# EAGLE design RBStation (EAGLE 6.1)
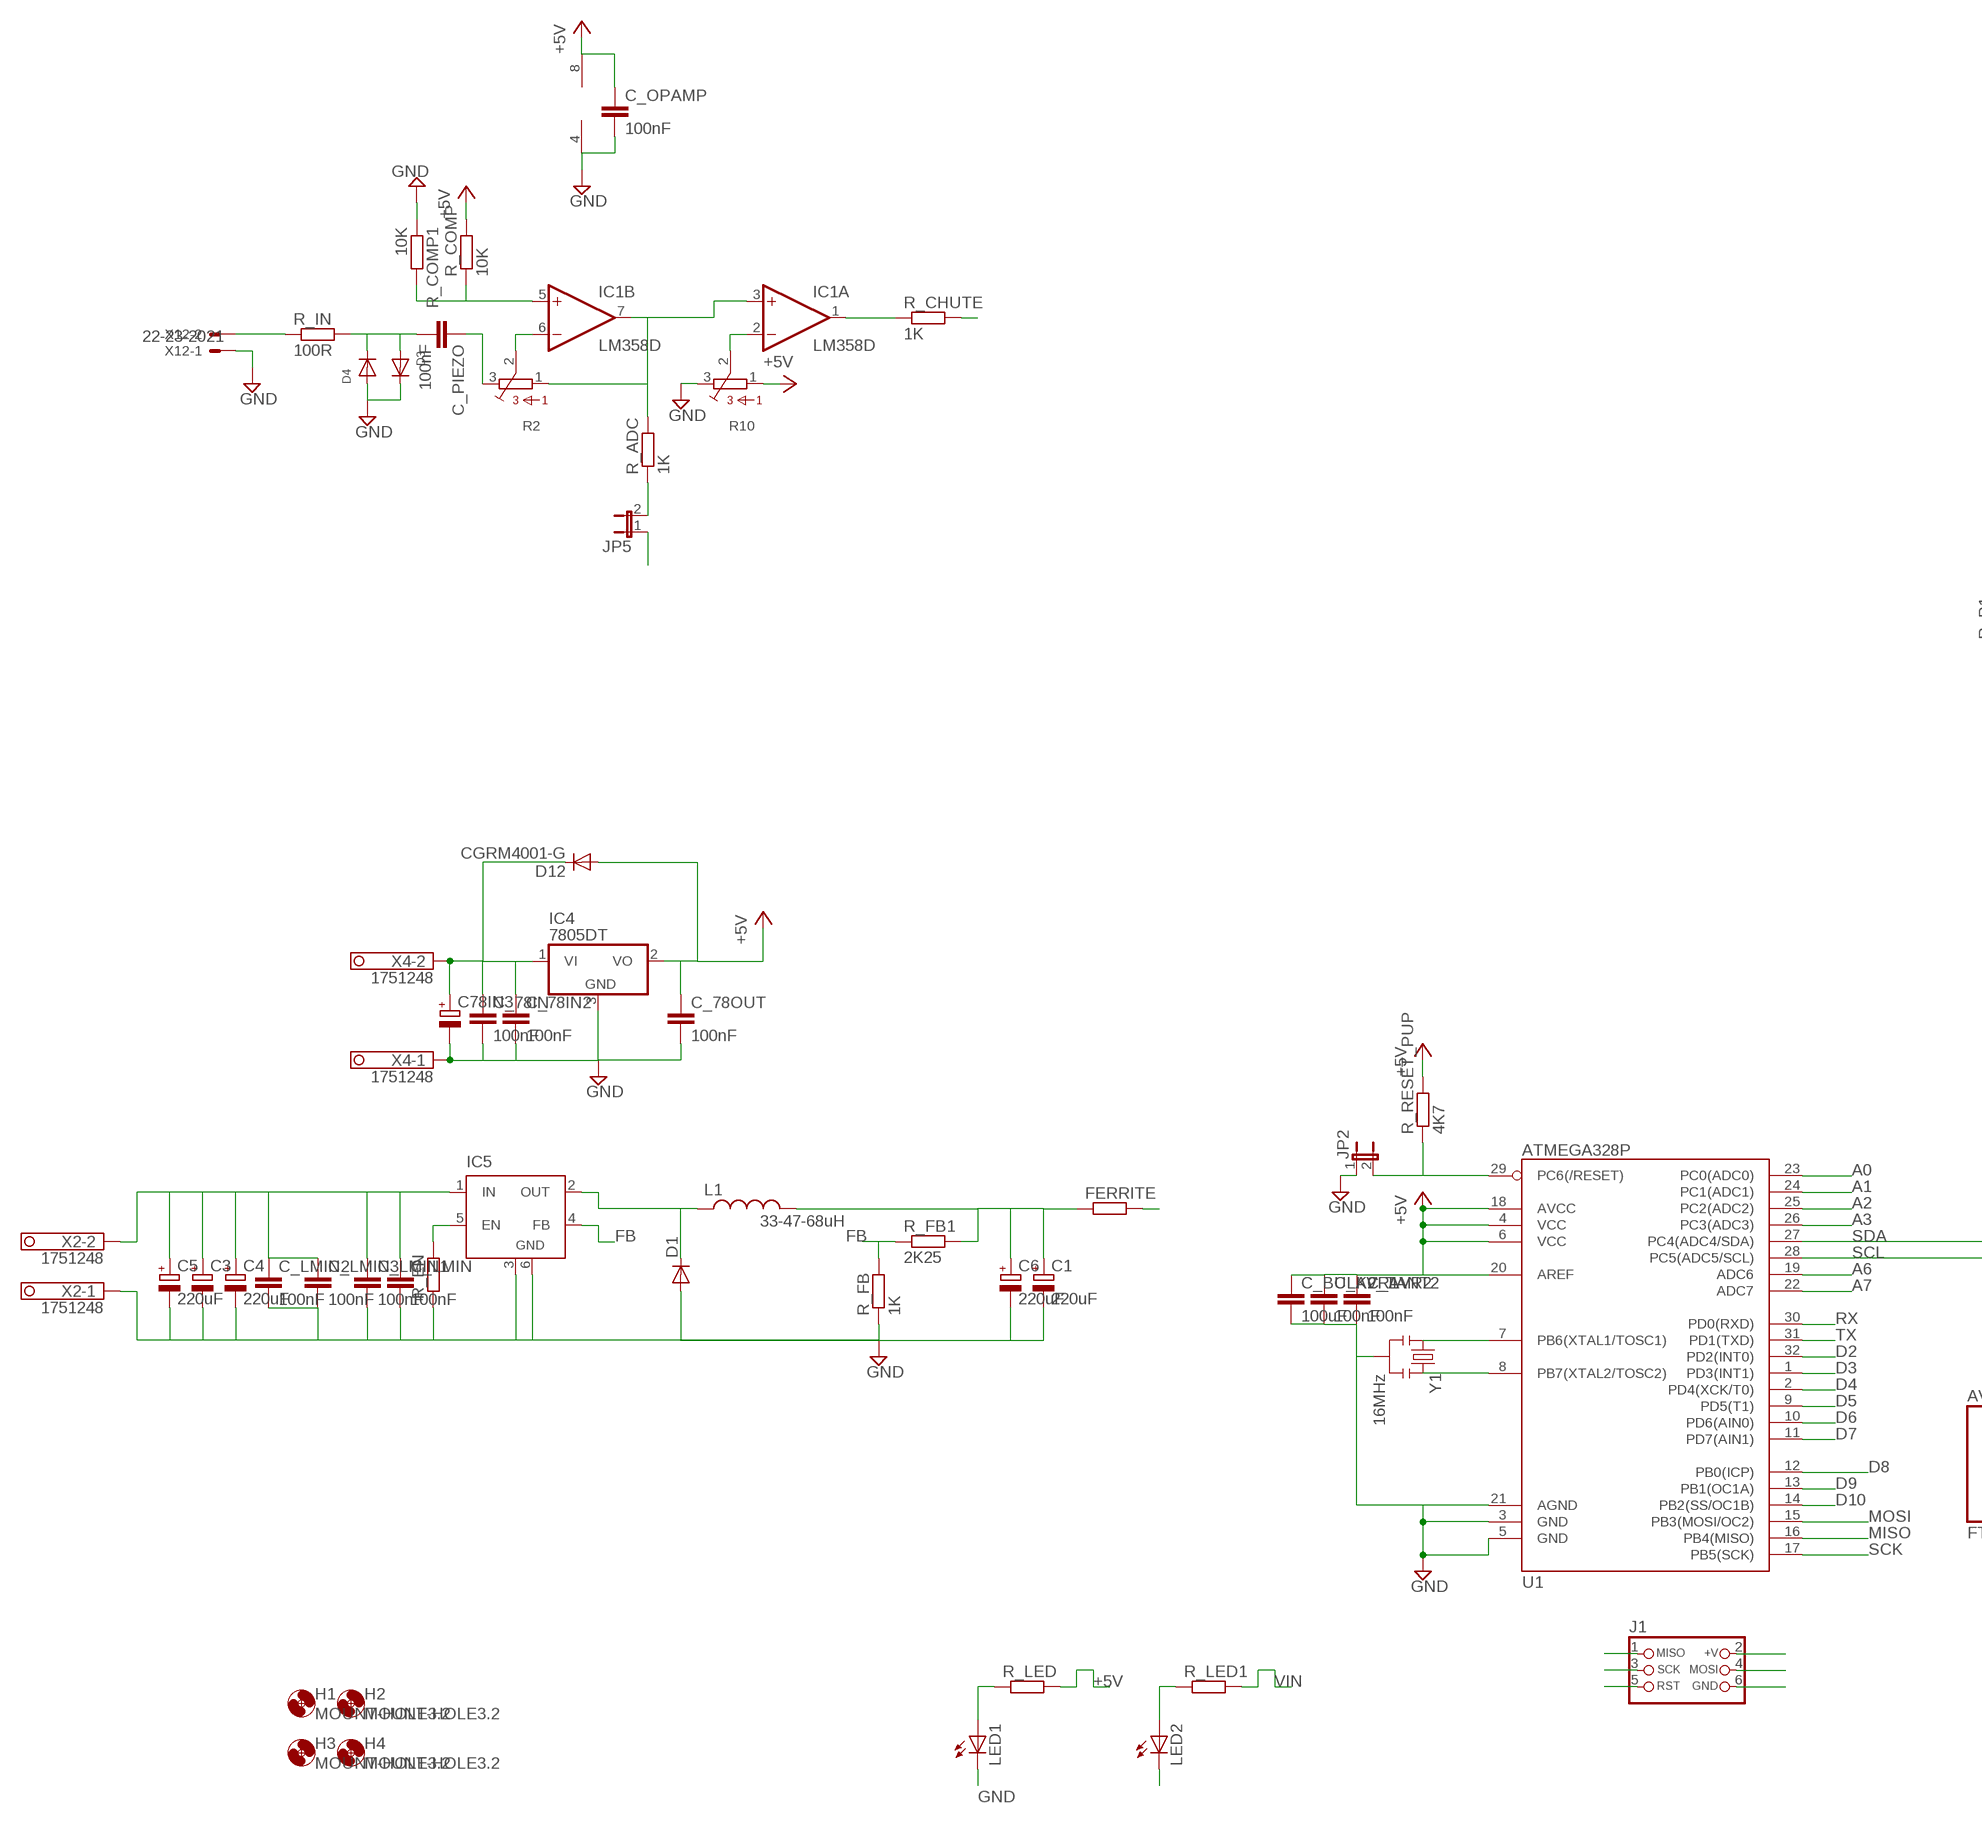
[diagram p0: schematic, sheet 1, part 1 of 2]
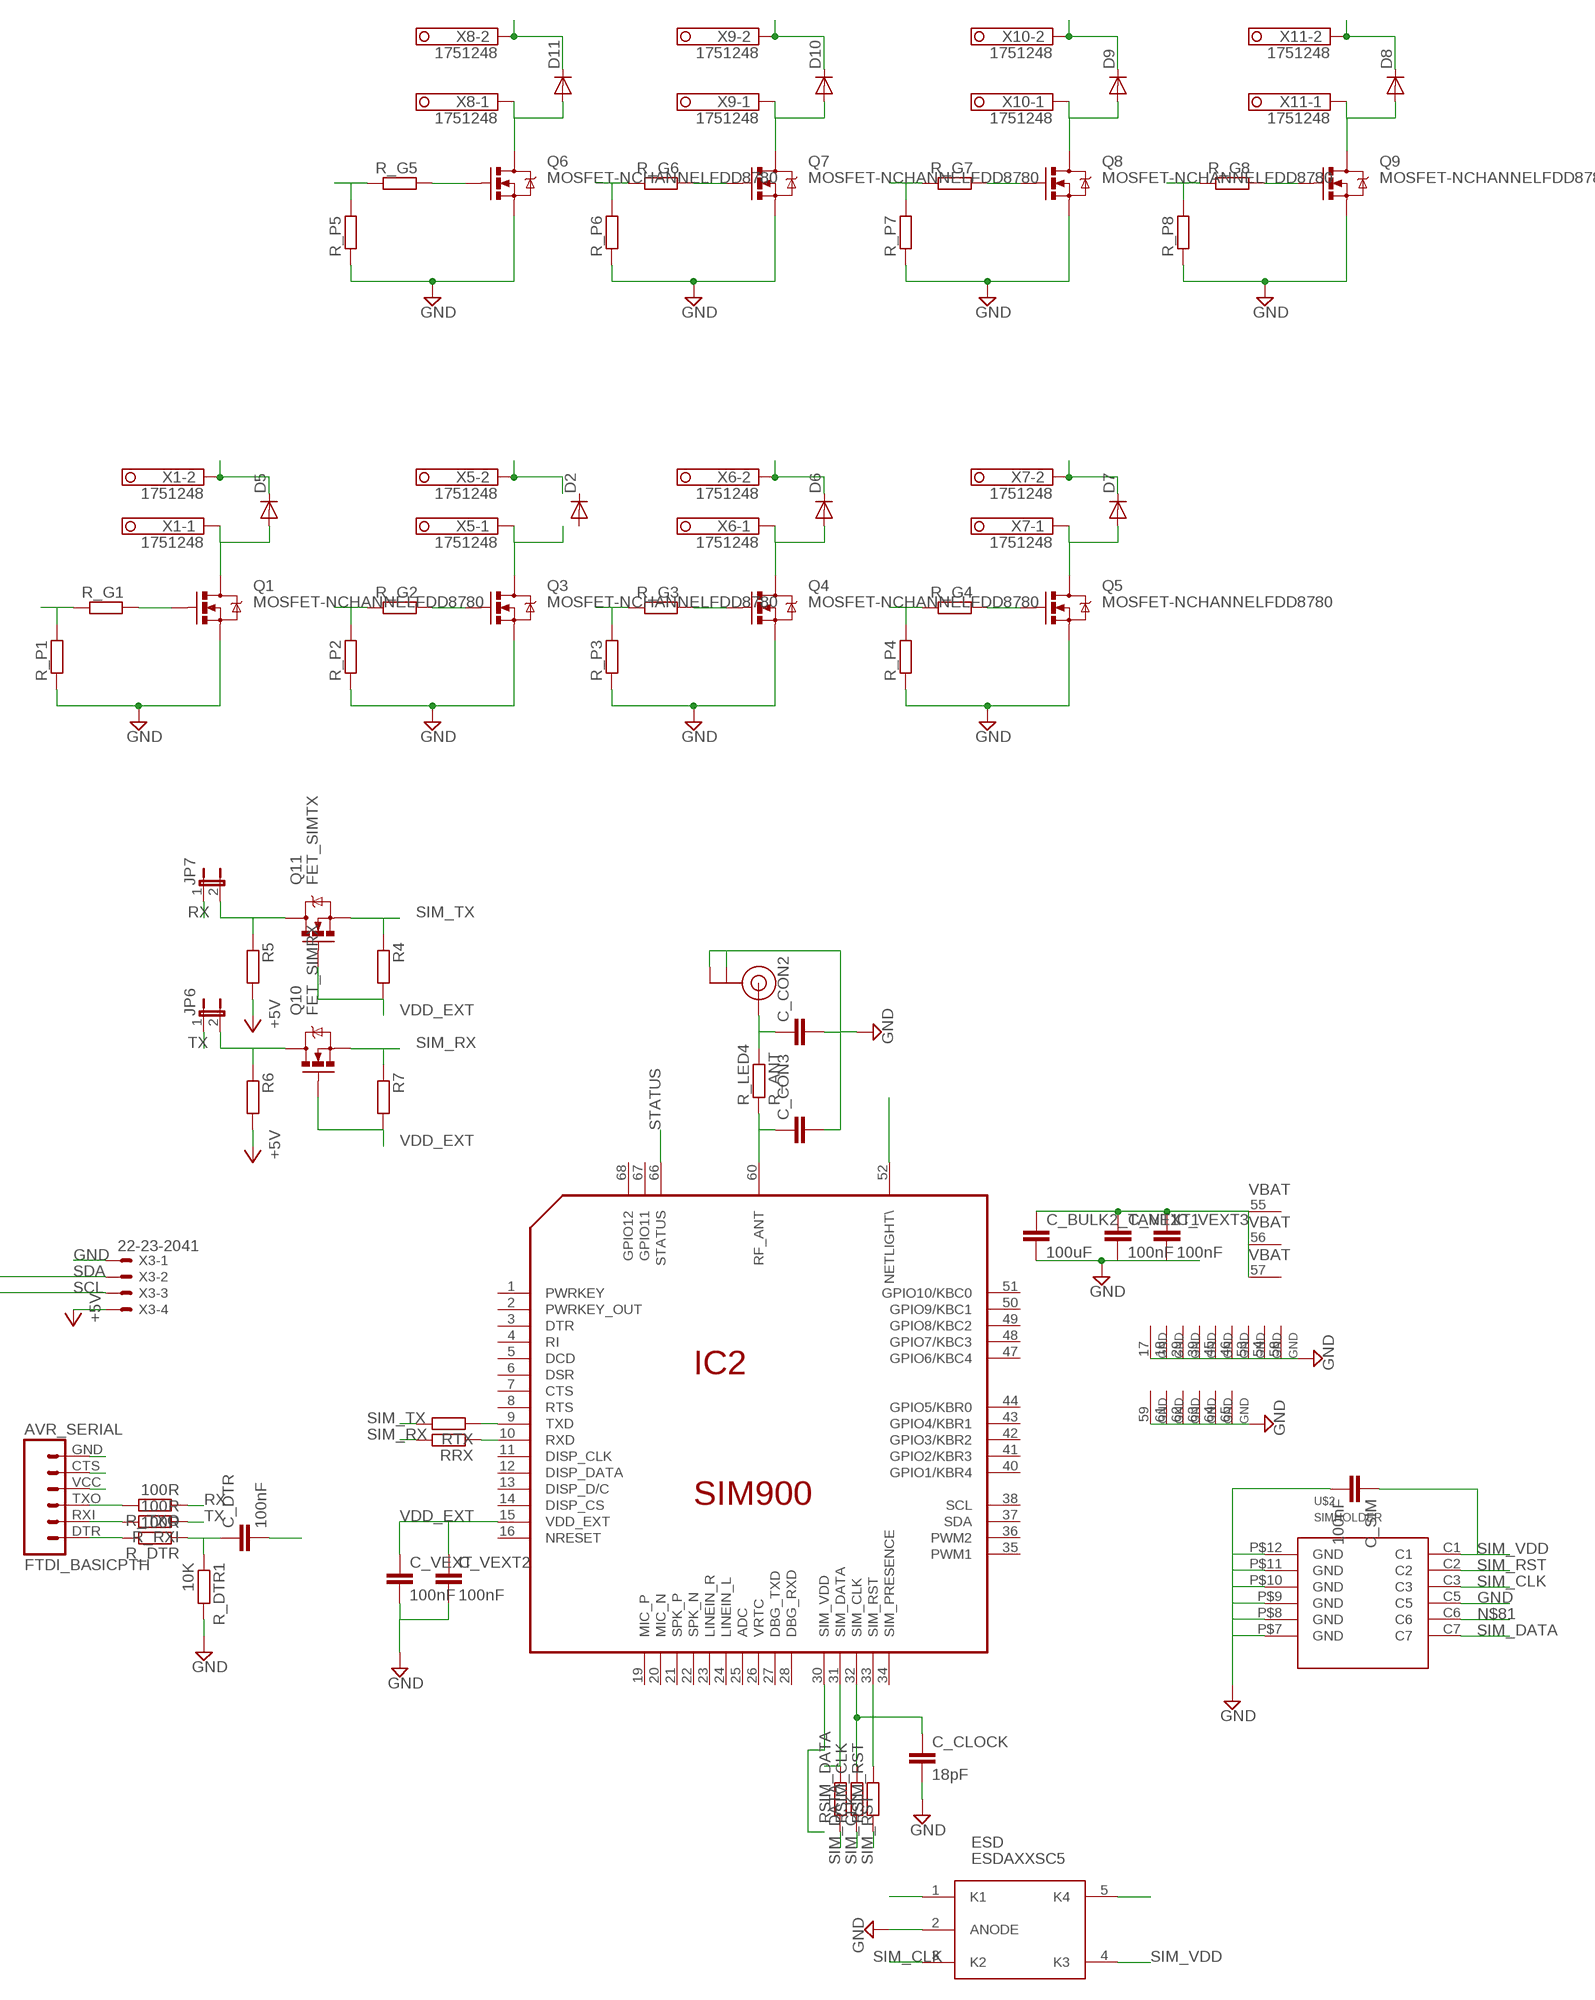
[diagram p1: schematic, sheet 1, part 2 of 2]

## Parts
AVR_SERIAL  FTDI_BASICPTH  [FTDI_BASIC]
C1  220uF  CPOL-EUF  [PANASONIC_F]
C3  CPOL-EUF  [PANASONIC_F]
C4  220uF  CPOL-EUF  [PANASONIC_F]
C5  220uF  CPOL-EUF  [PANASONIC_F]
C6  220uF  CPOL-EUF  [PANASONIC_F]
C78IN3  CPOL-EUF  [PANASONIC_F]
C_78IN  100nF  C-EUC0805  [C0805]
C_78IN2  100nF  C-EUC0805  [C0805]
C_78OUT  100nF  C-EUC0805  [C0805]
C_AVR1  100nF  C-EUC0805K  [C0805K]
C_AVR2  100nF  C-EUC0805  [C0805]
C_BULK2_TANT1  100uF  C-EUC1210  [C1210]
C_BULK2_TANT2  100uF  C-EUC1210  [C1210]
C_CLOCK  18pF  C-EUC0805  [C0805]
C_CON2  C-EUC0805  [C0805]
C_CON3  C-EUC0805  [C0805]
C_DTR  100nF  C-EUC0805K  [C0805K]
C_LMIN  100nF  C-EUC0805  [C0805]
C_LMIN1  100nF  C-EUC0805  [C0805]
C_LMIN2  100nF  C-EUC0805  [C0805]
C_LMIN3  100nF  C-EUC0805  [C0805]
C_OPAMP  100nF  C-EUC0805K  [C0805K]
C_PIEZO  100nF  C-EUC0805K  [C0805K]
C_SIM  100nF  C-EUC0805  [C0805]
C_VEXT  100nF  C-EUC0805K  [C0805K]
C_VEXT1  100nF  C-EUC0805K  [C0805K]
C_VEXT2  100nF  C-EUC0805K  [C0805K]
C_VEXT3  100nF  C-EUC1210  [C1210]
D1  DIODESMB  [SMB-DIODE]
D2  DIODESMA  [SMA-DIODE]
D3  DIODESOD-123  [SOD-123]
D4  DIODESOD-123  [SOD-123]
D5  DIODESMA  [SMA-DIODE]
D6  DIODESMA  [SMA-DIODE]
D7  DIODESMA  [SMA-DIODE]
D8  DIODESMA  [SMA-DIODE]
D9  DIODESMA  [SMA-DIODE]
D10  DIODESMA  [SMA-DIODE]
D11  DIODESMA  [SMA-DIODE]
D12  CGRM4001-G  [SOD-123_MINI-SMA]
ESD  ESDAXXSC5  [SOT23-5]
FERRITE  R-EU_R0805  [R0805]
H1  MOUNT-HOLE3.2  [3,2]
H2  MOUNT-HOLE3.2  [3,2]
H3  MOUNT-HOLE3.2  [3,2]
H4  MOUNT-HOLE3.2  [3,2]
IC1  LM358D  [SO08]
IC2  SIM900  [SIM900]
IC4  7805DT  [TO252]
IC5  LM2596S  [TO263-5]
J1  CON_HEADER_PRG_AVR_ICSP  [HEADER_PRG_2X03]
JP2  JUMPER-2SMD-NC  [SJ_2S]
JP5  JUMPER-2SMD-NC  [SJ_2S]
JP6  JUMPER-2PTH_LOCK  [1X02_LOCK]
JP7  JUMPER-2PTH_LOCK  [1X02_LOCK]
L1  33-47-68uH  BOURNS-SRR1280  [BOURNS-SRR1280]
LED1  LEDCHIP-LED0805  [CHIP-LED0805]
LED2  LEDCHIP-LED0805  [CHIP-LED0805]
Q1  MOSFET-NCHANNELFDD8780  [DPAK]
Q3  MOSFET-NCHANNELFDD8780  [DPAK]
Q4  MOSFET-NCHANNELFDD8780  [DPAK]
Q5  MOSFET-NCHANNELFDD8780  [DPAK]
Q6  MOSFET-NCHANNELFDD8780  [DPAK]
Q7  MOSFET-NCHANNELFDD8780  [DPAK]
Q8  MOSFET-NCHANNELFDD8780  [DPAK]
Q9  MOSFET-NCHANNELFDD8780  [DPAK]
Q10  FET_SIMRX  MOSFET-NCHANNELBSS138  [SOT23]
Q11  FET_SIMTX  MOSFET-NCHANNELBSS138  [SOT23]
R2  3386-F  [3386F]
R4  R-EU_R0805  [R0805]
R5  R-EU_R0805  [R0805]
R6  R-EU_R0805  [R0805]
R7  R-EU_R0805  [R0805]
R10  3386-F  [3386F]
R_ADC  1K  R-EU_M0805  [M0805]
R_CHUTE  1K  R-EU_M0805  [M0805]
R_COMP  10K  R-EU_M0805  [M0805]
R_COMP1  10K  R-EU_M0805  [M0805]
R_DTR  100R  R-EU_M0805  [M0805]
R_DTR1  10K  R-EU_M0805  [M0805]
R_EN  R-EU_M0805  [M0805]
R_FB  1K  R-EU_M0805  [M0805]
R_FB1  2K25  R-EU_M0805  [M0805]
R_G1  R-EU_M0805  [M0805]
R_G2  R-EU_M0805  [M0805]
R_G3  R-EU_M0805  [M0805]
R_G4  R-EU_M0805  [M0805]
R_G5  R-EU_M0805  [M0805]
R_G6  R-EU_M0805  [M0805]
R_G7  R-EU_M0805  [M0805]
R_G8  R-EU_M0805  [M0805]
R_IN  100R  R-EU_M0805  [M0805]
R_LED  R-EU_M0805  [M0805]
R_LED1  R-EU_M0805  [M0805]
R_LED4  R_ANT  R-EU_R0805  [R0805]
R_P1  R-EU_M0805  [M0805]
R_P2  R-EU_M0805  [M0805]
R_P3  R-EU_M0805  [M0805]
R_P4  R-EU_M0805  [M0805]
R_P5  R-EU_M0805  [M0805]
R_P6  R-EU_M0805  [M0805]
R_P7  R-EU_M0805  [M0805]
R_P8  R-EU_M0805  [M0805]
R_RESET_PUP  4K7  R-EU_M0805  [M0805]
R_RXI  100R  R-EU_M0805  [M0805]
R_TXO  100R  R-EU_M0805  [M0805]
RRX  R-EU_M0805  [M0805]
RSIM_CLK  R-EU_M0805  [M0805]
RSIM_DATA  R-EU_M0805  [M0805]
RSIM_RST  R-EU_M0805  [M0805]
RTX  R-EU_M0805  [M0805]
U1  ATMEGA328P  ATMEGA328_SMT  [TQFP32-08]
U$1  U.FL  [U.FL]
U$2  SIMHOLDER  [WM9364CT-ND]
X1  1751248  [1751248]
X2  1751248  [1751248]
X3  22-23-2041  [22-23-2041]
X4  1751248  [1751248]
X5  1751248  [1751248]
X6  1751248  [1751248]
X7  1751248  [1751248]
X8  1751248  [1751248]
X9  1751248  [1751248]
X10  1751248  [1751248]
X11  1751248  [1751248]
X12  22-23-2021  [22-23-2021]
Y1  16MHz  RESONATOR16MHZ  [RESONATOR-SMD]

## Nets
+5V: C_78OUT.1 C_AVR1.1 C_AVR2.1 C_BULK2_TANT2.1 C_OPAMP.1 D12.A IC1.8(P:V+) IC4.2(VO) J1.2(+V) R5.2 R6.2 R10.1 R_COMP.2 R_LED.2 R_RESET_PUP.2 U1.4(VCC) U1.6(VCC) U1.18(AVCC) U1.20(AREF) X3.4
A0: JP5.1 U1.23(PC0(ADC0))
A1: U1.24(PC1(ADC1))
A2: U1.25(PC2(ADC2))
A3: U1.26(PC3(ADC3))
A6: U1.19(ADC6)
A7: U1.22(ADC7)
C_CLK: C_CLOCK.1 IC2.32(SIM_CLK) RSIM_CLK.2
D2: R_CHUTE.2 U1.32(PD2(INT0))
D3: R_G1.1 R_P1.2 U1.1(PD3(INT1))
D4: R_G2.1 R_P2.2 U1.2(PD4(XCK/T0))
D5: R_G5.1 R_P5.2 U1.9(PD5(T1))
D6: R_G6.1 R_P6.2 U1.10(PD6(AIN0))
D7: R_G3.1 R_P3.2 U1.11(PD7(AIN1))
D8: R_G4.1 R_P4.2 U1.12(PB0(ICP))
D9: R_G7.1 R_P7.2 U1.13(PB1(OC1A))
D10: R_G8.1 R_P8.2 U1.14(PB2(SS/OC1B))
FB: IC5.4(FB) R_FB1.1 R_FB.2
GND: AVR_SERIAL.GND C1.- C3.- C4.- C5.- C6.- C78IN3.- C_78IN2.2 C_78IN.2 C_78OUT.2 C_AVR1.2 C_AVR2.2 C_BULK2_TANT1.2 C_BULK2_TANT2.2 C_CLOCK.2 C_CON2.2 C_CON3.2 C_LMIN1.2 C_LMIN2.2 C_LMIN3.2 C_LMIN.2 C_OPAMP.2 C_SIM.2 C_VEXT1.2 C_VEXT2.2 C_VEXT3.2 C_VEXT.2 D1.A D3.C D4.A ESD.2(ANODE) IC1.4(P:V-) IC2.17(GND) IC2.18(GND) IC2.29(GND) IC2.39(GND) IC2.45(GND) IC2.46(GND) IC2.53(GND) IC2.54(GND) IC2.58(GND) IC2.59(GND) IC2.61(GND) IC2.62(GND) IC2.63(GND) IC2.64(GND) IC2.65(GND) IC4.3(GND) IC5.3(GND) IC5.6(GND) J1.6(GND) JP2.1 LED1.C LED2.C Q1.3(S) Q3.3(S) Q4.3(S) Q5.3(S) Q6.3(S) Q7.3(S) Q8.3(S) Q9.3(S) R10.3 R_COMP1.1 R_DTR1.2 R_EN.1 R_FB.1 R_P1.1 R_P2.1 R_P3.1 R_P4.1 R_P5.1 R_P6.1 R_P7.1 R_P8.1 U1.3(GND) U1.5(GND) U1.21(AGND) U$2.C5 U$2.P$7(GND) U$2.P$8(GND) U$2.P$9(GND) U$2.P$10(GND) U$2.P$11(GND) U$2.P$12(GND) X2.1 X3.1 X4.1 X12.1 Y1.2
MISO: J1.1(MISO) U1.16(PB4(MISO))
MOSI: J1.4(MOSI) U1.15(PB3(MOSI/OC2))
N$1: Q1.1(G) R_G1.2
N$2: D1.C IC5.2(OUT) L1.P$2
N$3: C_PIEZO.1 R2.3
N$4: D5.A Q1.4(D) X1.1
N$5: U1.7(PB6(XTAL1/TOSC1)) Y1.1
N$6: C_CON2.1 R_LED4.2 U$1.P$3(SIGNAL)
N$7: C_CON3.1 IC2.60(RF_ANT) R_LED4.1
N$8: IC2.31(SIM_DATA) RSIM_DATA.2
N$9: U$1.P$1(GND) U$1.P$2(GND)
N$10: R_IN.1 X12.2
N$11: U1.8(PB7(XTAL2/TOSC2)) Y1.3
N$12: IC2.33(SIM_RST) RSIM_RST.2
N$13: IC1.6(B:-IN) R2.2
N$15: JP5.2 R_ADC.1
N$16: IC1.2(A:-IN) R10.2
N$18: C_BULK2_TANT1.1 C_VEXT1.1 C_VEXT3.1 FERRITE.2 IC2.55(VBAT) IC2.56(VBAT) IC2.57(VBAT)
N$20: LED2.A R_LED1.1
N$22: C_PIEZO.2 D3.A D4.C R_IN.2
N$26: IC1.3(A:+IN) IC1.7(B:OUT) R2.1 R_ADC.2
N$28: Q3.1(G) R_G2.2
N$36: Q3.4(D) X5.1
N$37: AVR_SERIAL.VCC
N$38: C_DTR.1 R_DTR1.1 R_DTR.1
N$39: AVR_SERIAL.TXO R_TXO.2
N$40: AVR_SERIAL.RXI R_RXI.2
N$41: AVR_SERIAL.DTR R_DTR.2
N$42: AVR_SERIAL.CTS
N$47: Q4.1(G) R_G3.2
N$48: D6.A Q4.4(D) X6.1
N$49: Q5.1(G) R_G4.2
N$50: LED1.A R_LED.1
N$51: D7.A Q5.4(D) X7.1
N$52: Q6.1(G) R_G5.2
N$53: D11.A Q6.4(D) X8.1
N$54: Q7.1(G) R_G6.2
N$55: D10.A Q7.4(D) X9.1
N$56: Q8.1(G) R_G7.2
N$57: D9.A Q8.4(D) X10.1
N$58: Q9.1(G) R_G8.2
N$59: D8.A Q9.4(D) X11.1
N$60: IC2.9(TXD) RTX.1
N$61: IC2.10(RXD) RRX.1
N$67: JP7.2 Q11.3(D) R5.1
N$71: JP6.2 Q10.3(D) R6.1
N$79: C1.+ C6.+ FERRITE.1 L1.P$1 R_FB1.2
N$80: IC5.5(EN) R_EN.2
N$81: U$2.C6
N$82: IC1.1(A:OUT) R_CHUTE.1
NETLIGHT: IC2.52(NETLIGHT\)
RESET: C_DTR.2 J1.5(RST) JP2.2 R_RESET_PUP.1 U1.29(PC6(/RESET))
ROITE: IC1.5(B:+IN) R_COMP1.2 R_COMP.1
RX: JP7.1 R_TXO.1 U1.30(PD0(RXD))
SCK: J1.3(SCK) U1.17(PB5(SCK))
SCL: U1.28(PC5(ADC5/SCL)) X3.3
SDA: U1.27(PC4(ADC4/SDA)) X3.2
SIM_CLK: ESD.3(K2) RSIM_CLK.1 U$2.C3
SIM_DATA: ESD.1(K1) RSIM_DATA.1 U$2.C7
SIM_RST: ESD.5(K4) RSIM_RST.1 U$2.C2
SIM_RX: Q10.2(S) R7.1 RRX.2
SIM_TX: Q11.2(S) R4.1 RTX.2
SIM_VDD: C_SIM.1 ESD.4(K3) IC2.30(SIM_VDD) U$2.C1
STATUS: IC2.66(STATUS)
TX: JP6.1 R_RXI.1 U1.31(PD1(TXD))
VDD_EXT: C_VEXT2.1 C_VEXT.1 IC2.15(VDD_EXT) Q10.1(G) Q11.1(G) R4.2 R7.2
VIN: C3.+ C4.+ C5.+ C_LMIN1.1 C_LMIN2.1 C_LMIN3.1 C_LMIN.1 D5.C D6.C D7.C IC5.1(IN) R_LED1.2 X1.2 X2.2 X5.2 X6.2 X7.2
VIN2: C78IN3.+ C_78IN2.1 C_78IN.1 D8.C D9.C D10.C D11.C D12.C IC4.1(VI) X4.2 X8.2 X9.2 X10.2 X11.2
Unconnected: D2.A D2.C IC2.1(PWRKEY) IC2.2(PWRKEY_OUT) IC2.3(DTR) IC2.4(RI) IC2.5(DCD) IC2.6(DSR) IC2.7(CTS) IC2.8(RTS) IC2.11(DISP_CLK) IC2.12(DISP_DATA) IC2.13(DISP_D/C) IC2.14(DISP_CS) IC2.16(NRESET) IC2.19(MIC_P) IC2.20(MIC_N) IC2.21(SPK_P) IC2.22(SPK_N) IC2.23(LINEIN_R) IC2.24(LINEIN_L) IC2.25(ADC) IC2.26(VRTC) IC2.27(DBG_TXD) IC2.28(DBG_RXD) IC2.34(SIM_PRESENCE) IC2.35(PWM1) IC2.36(PWM2) IC2.37(SDA) IC2.38(SCL) IC2.40(GPIO1/KBR4) IC2.41(GPIO2/KBR3) IC2.42(GPIO3/KBR2) IC2.43(GPIO4/KBR1) IC2.44(GPIO5/KBR0) IC2.47(GPIO6/KBC4) IC2.48(GPIO7/KBC3) IC2.49(GPIO8/KBC2) IC2.50(GPIO9/KBC1) IC2.51(GPIO10/KBC0) IC2.67(GPIO11) IC2.68(GPIO12)

## Library data of the parts
AVR_SERIAL = SparkFun-Connectors:FTDI_BASIC: FTDI Basic header with labels
C1 C3-C6 C78IN3 = rcl:CPOL-EU: POLARIZED CAPACITOR, European symbol
C_78IN C_78IN2 C_78OUT C_AVR1 C_AVR2 C_BULK2_TANT1 C_BULK2_TANT2 C_CLOCK C_CON2 C_CON3 C_DTR C_LMIN C_LMIN1-C_LMIN3 C_OPAMP C_PIEZO C_SIM C_VEXT C_VEXT1-C_VEXT3 = resistor:C-EU: CAPACITOR, European symbol
D1 D2 D5-D11 = SparkFun-DiscreteSemi:DIODE: Diode
D3 D4 = adafruit:DIODE: Diode
D12 = diode:CGRM400*-G: Molded plasitc,JEDEC SOD-123/Mini SMA Source: Comchip CGRM4001-G.pdf
ESD = wes:ESDAXXSC5
FERRITE R4-R7 = rcl:R-EU_: RESISTOR, European symbol
H1-H4 = holes:MOUNT-HOLE: MOUNTING HOLE with drill center marker
IC1 = linear:LM358: OP AMP also LM158; LM258; LM2904 Source: http://cache.national.com/ds/LM/LM158.pdf
IC2 = sim900:SIM900
IC4 = adafruit:78*: Positive VOLTAGE REGULATOR Added bigger pads to the TO-92 package
IC5 = linear:LM2596S: STEP-DOWN VOLTAGE REGULATOR
J1 = nonolith:CON_HEADER_PRG_AVR_ICSP: 2x3 AVR ICSP programming header
JP2 JP5-JP7 = SparkFun-Passives:JUMPER-2: Jumper Basic 0.1" spaced jumper. Use with breakaway headers.
L1 = inductor-sen:BOURNS-SRR1280
LED1 LED2 = led:LED: LED OSRAM: - CHIPLED LG R971, LG N971, LY N971, LG Q971, LY Q971, LO R971, LY R971 LH N974, LH R974 LS Q976, LO Q976, LY Q976 LO Q996 - Hyper CHIPLED LW Q18S LB Q993, LB Q99A, LB R99A - SideLED LS A670, LO A670, LY A670, LG A670, LP A670 LB A673, LV A673, LT A673, LW A673 LH A674 LY A675 LS A676, LA A676, LO A676, LY A676, LW A676 LS A679, LY A679, LG A679 - Hyper Micro SIDELED® LS Y876, LA Y876, LO Y876, LY Y876 LT Y87S - SmartLED LW L88C, LW L88S LB L89C, LB L89S, LG L890 LS L89K, LO L89K, LY L89K LS L896, LA L896, LO L896, LY L896 - TOPLED LS T670, LO T670, LY T670, LG T670, LP T670 LSG T670, LSP T670, LSY T670, LOP T670, LYG T670 LG T671, LOG T671, LSG T671 LB T673, LV T673, LT T673, LW T673 LH T674 LS T676, LA T676, LO T676, LY T676, LB T676, LH T676, LSB T676, LW T676 LB T67C, LV T67C, LT T67C, LS T67K, LO T67K, LY T67K, LW E67C LS E67B, LA E67B, LO E67B, LY E67B, LB E67C, LV E67C, LT E67C LW T67C LS T679, LY T679, LG T679 LS T770, LO T770, LY T770, LG T770, LP T770 LB T773, LV T773, LT T773, LW T773 LH T774 LS E675, LA E675, LY E675, LS T675 LS T776, LA T776, LO T776, LY T776, LB T776 LHGB T686 LT T68C, LB T68C - Hyper Mini TOPLED® LB M676 - Mini TOPLED Santana® LG M470 LS M47K, LO M47K, LY M47K Source: http://www.osram.convergy.de LUXEON: - LUMILED® LXK2-PW12-R00, LXK2-PW12-S00, LXK2-PW14-U00, LXK2-PW14-V00 LXK2-PM12-R00, LXK2-PM12-S00, LXK2-PM14-U00 LXK2-PE12-Q00, LXK2-PE12-R00, LXK2-PE12-S00, LXK2-PE14-T00, LXK2-PE14-U00 LXK2-PB12-K00, LXK2-PB12-L00, LXK2-PB12-M00, LXK2-PB14-N00, LXK2-PB14-P00, LXK2-PB14-Q00 LXK2-PR12-L00, LXK2-PR12-M00, LXK2-PR14-Q00, LXK2-PR14-R00 LXK2-PD12-Q00, LXK2-PD12-R00, LXK2-PD12-S00 LXK2-PH12-R00, LXK2-PH12-S00 LXK2-PL12-P00, LXK2-PL12-Q00, LXK2-PL12-R00 Source: www.luxeon.com KINGBRIGHT: KA-3528ASYC Source: www.kingbright.com
Q1 Q3-Q9 = SparkFun-DiscreteSemi:MOSFET-NCHANNEL: Common NMOSFET Parts MFG P/N Store ID Prod ID FDD8780 TRANS-09984 SI7820DN TRANS-11055 FDS6630A IC-08089 2N7002PW TRANS-11151 FQP30N06L COM-10213 TRANS-10060 BSS123LT1G TRANS-08345 BSS138 TRANS-00830 BS170 2N7000; PROD_ID: TRANS-09984
Q10 Q11 = SparkFun-DiscreteSemi:MOSFET-NCHANNEL: Common NMOSFET Parts MFG P/N Store ID Prod ID FDD8780 TRANS-09984 SI7820DN TRANS-11055 FDS6630A IC-08089 2N7002PW TRANS-11151 FQP30N06L COM-10213 TRANS-10060 BSS123LT1G TRANS-08345 BSS138 TRANS-00830 BS170 2N7000; PROD_ID: TRANS-00830
R2 R10 = bourns:3386-: 3386 Series 3/8" Square Trimmer
R_ADC R_CHUTE R_COMP R_COMP1 R_DTR R_DTR1 R_EN R_FB R_FB1 R_G1-R_G8 R_IN R_LED R_LED1 R_LED4 R_P1-R_P8 R_RESET_PUP R_RXI R_TXO RRX RSIM_CLK RSIM_DATA RSIM_RST RTX = resistor:R-EU_: RESISTOR, European symbol
U1 = SparkFun-DigitalIC:ATMEGA328_SMT: 32-Pin Atmega328 part Commonly used on Arduino compatible boards Available in QFP and QFN packages TQFP is IC-09069 QFN is non-stock; PROD_ID: IC-09069
U$1 = SparkFun-Connectors:U.FL: SMD antenna connector- WRL-09144
U$2 = wes:SIMHOLDER
X1 X2 X4-X11 = con-phoenix-350:1751248: MKDS 1/ 2-3,5 Printklemme Nennstrom: 10 A Bemessungsspannung: 160 V Raster: 3,5 mm Polzahl: 2 Montageart: Löten Anschlussart: Schraubanschluss Anschlussrichtung vom Leiter zur Platine: 0° Source: http://eshop.phoenixcontact.com .. 1751248.pdf; OC_FARNELL: unknown; OC_NEWARK: unknown
X3 = con-molex:22-23-2041: .100" (2.54mm) Center Header - 4 Pin; MF: MOLEX; MPN: 22-23-2041; OC_FARNELL: 1462920; OC_NEWARK: 38C0355
X12 = con-molex:22-23-2021: .100" (2.54mm) Center Header - 2 Pin; MF: MOLEX; MPN: 22-23-2021; OC_FARNELL: 1462926; OC_NEWARK: 25C3832
Y1 = SparkFun-FreqCtrl:RESONATOR: Resonator Small SMD resonator. Used, eg, on the Arduino Pro/ Pro Mini boards. 8MHz- XTAL-08895 16MHz- XTAL-08900; PROD_ID: XTAL-08900

## Board
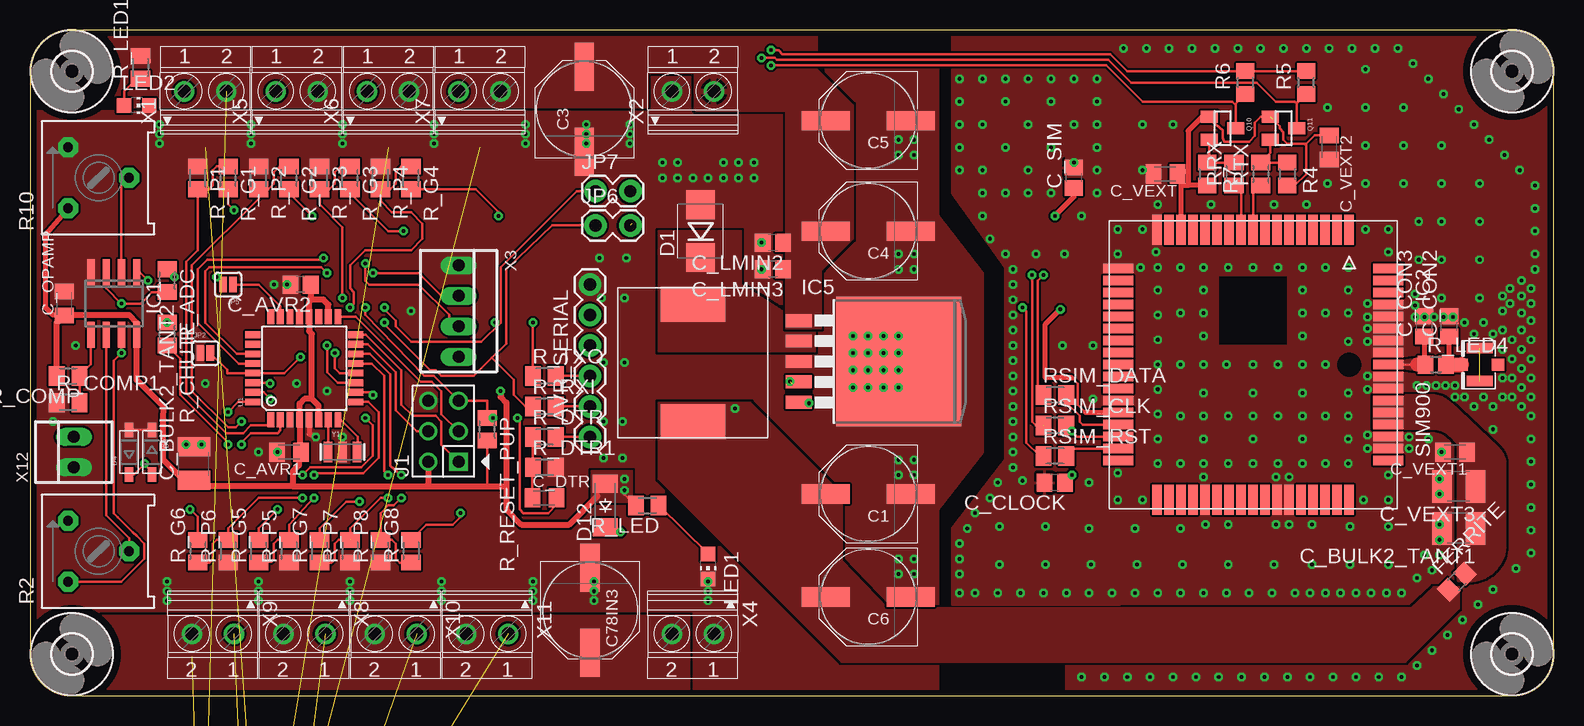
[diagram p2: board, top side]
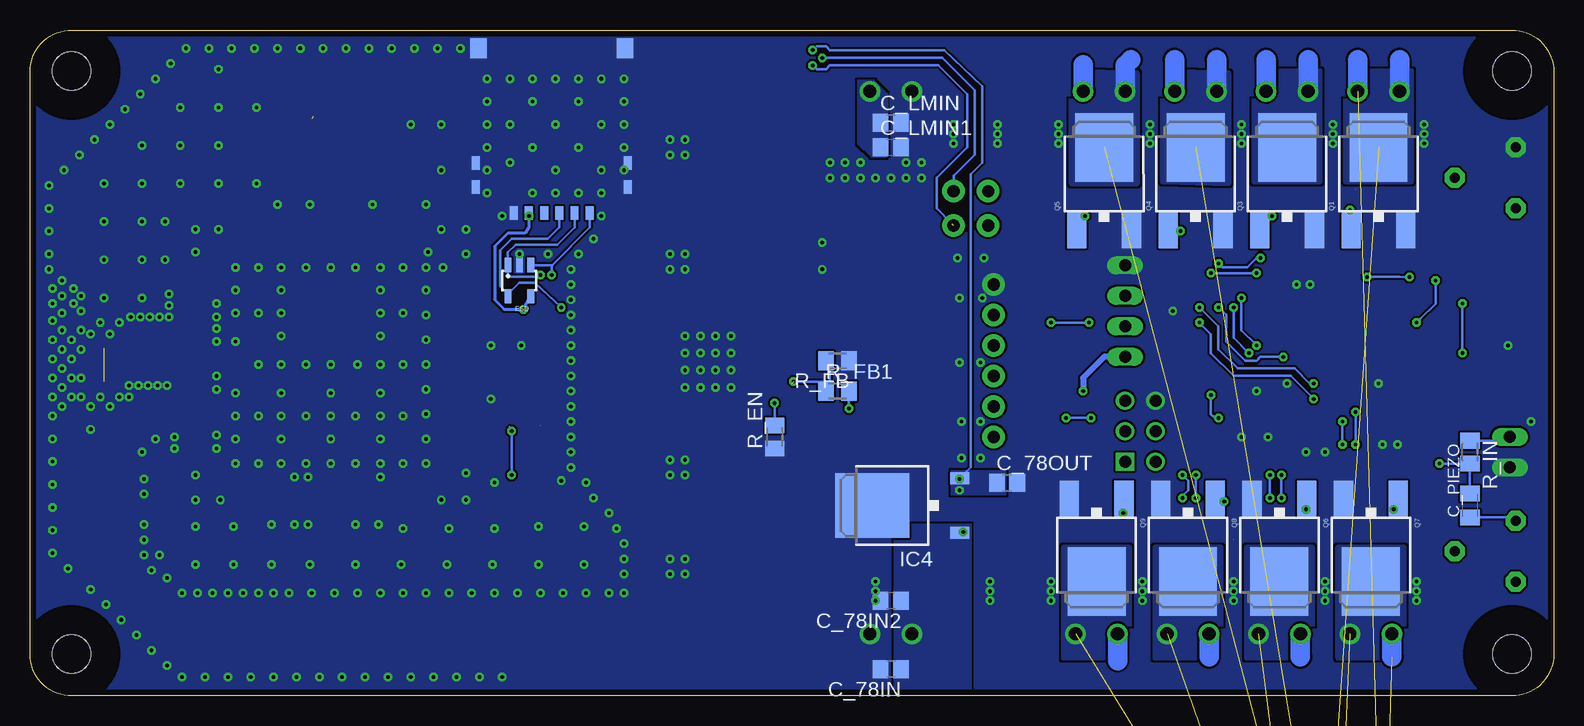
[diagram p3: board, bottom side, seen from below]

Size 126.98 x 55.5 mm. Coordinates in mm from the lower left corner, seen from the top.
Outline: 0,52 0,3.5 arc90 3.5,0 123.48,0 arc90 126.98,3.5 126.98,52 arc90 123.48,55.5 3.5,55.5 arc90 0,52
Copper layers (1*16): Top 0.035mm / dielectric 1.5mm / Bottom 0.035mm
Design rules: minimum track width 8mil, minimum drill 0.29mm, track to track 7mil, track to pad 7mil, pad to pad 7mil, via to via 7mil, smd to smd 7mil, copper to edge 20mil, drill to drill 8mil, minimum pad ring 10mil, minimum via ring 8mil, stop-mask expansion 4mil, vias tented up to drill 0.4mm, thermal gap 10mil

### Footprints (pad centres in the part's own frame; a part is rotated, then mirrored left to right if it is on the bottom)
FTDI_BASIC = drill 1.016 pad 1.88: CTS 10.16,0; DTR 0,0; GND 12.7,0; RXI 2.54,0; TXO 5.08,0; VCC 7.62,0
PANASONIC_F = smd 4 x 1.6: + 3.55,0; - -3.55,0
C0805 = smd 1.3 x 1.5: 1 -0.85,0; 2 0.85,0
C0805K = smd 1.3 x 1.6: 1 -1,0; 2 1,0
C1210 = smd 1.6 x 2.7: 1 -1.4,0; 2 1.4,0
SMB-DIODE = smd 2.4 x 2.4: A 2.2,0; C -2.2,0
SMA-DIODE = smd 1.27 x 1.47: A -2.15,0; C 2.15,0
SOD-123 = smd 1.2 x 0.7: A 1.85,0; C -1.85,0
SOD-123_MINI-SMA = smd 1.5 x 2.1: A 1.8,0; C -1.8,0
SOT23-5 = smd 0.55 x 1.2: 1 0.95,-1.3; 2 0,-1.3; 3 -0.95,-1.3; 4 -0.95,1.3; 5 0.95,1.3
R0805 = smd 1.3 x 1.5: 1 -0.95,0; 2 0.95,0
3,2 = hole 3.2: 0,0
SO08 = smd 0.6 x 2.2: 1 -1.905,-2.6; 2 -0.635,-2.6; 3 0.635,-2.6; 4 1.905,-2.6; 5 1.905,2.6; 6 0.635,2.6; 7 -0.635,2.6; 8 -1.905,2.6
SIM900 = smd 2.5 x 0.8: 1 -11.25,8; 2 -11.25,7; 3 -11.25,6; 4 -11.25,5; 5 -11.25,4; 6 -11.25,3; 7 -11.25,2; 8 -11.25,1; 9 -11.25,0; 10 -11.25,-1; 11 -11.25,-2; 12 -11.25,-3; 13 -11.25,-4; 14 -11.25,-5; 15 -11.25,-6; 16 -11.25,-7; 17 -11.25,-8; 35 11.25,-8; 36 11.25,-7; 37 11.25,-6; 38 11.25,-5; 39 11.25,-4; 40 11.25,-3; 41 11.25,-2; 42 11.25,-1; 43 11.25,0; 44 11.25,1; 45 11.25,2; 46 11.25,3; 47 11.25,4; 48 11.25,5; 49 11.25,6; 50 11.25,7; 51 11.25,8 | smd 0.8 x 2.5: 18 -8,-11.25; 19 -7,-11.25; 20 -6,-11.25; 21 -5,-11.25; 22 -4,-11.25; 23 -3,-11.25; 24 -2,-11.25; 25 -1,-11.25; 26 0,-11.25; 27 1,-11.25; 28 2,-11.25; 29 3,-11.25; 30 4,-11.25; 31 5,-11.25; 32 6,-11.25; 33 7,-11.25; 34 8,-11.25; 52 8,11.25; 53 7,11.25; 54 6,11.25; 55 5,11.25; 56 4,11.25; 57 3,11.25; 58 2,11.25; 59 1,11.25; 60 0,11.25; 61 -1,11.25; 62 -2,11.25; 63 -3,11.25; 64 -4,11.25; 65 -5,11.25; 66 -6,11.25; 67 -7,11.25; 68 -8,11.25
TO252 = smd 1 x 1.6: 1 -2.28,-4.8; 2 2.28,-4.8 | smd 5.4 x 6.2: 3 0,2.5
TO263-5 = smd 1.067 x 2.159: 1 -3.404,-5.791; 2 -1.702,-5.791; 3 0,-5.791; 4 1.702,-5.791; 5 3.404,-5.791 | smd 10.8 x 10.41: 6 0,2.54
HEADER_PRG_2X03 = drill 1.016 square: 1 -2.54,-1.27 | drill 1.016: 2 -2.54,1.27; 3 0,-1.27; 4 0,1.27; 5 2.54,-1.27; 6 2.54,1.27
SJ_2S = smd 0.635 x 1.27: 1 -0.412,0; 2 0.412,0
1X02_LOCK = drill 1.016 pad 1.88: 1 -0.178,0; 2 2.718,0
BOURNS-SRR1280 = smd 2.9 x 5.4: P$1 -4.9,0; P$2 4.9,0
CHIP-LED0805 = smd 1.2 x 1.2: A 0,-1.05; C 0,1.05
DPAK = smd 1.6 x 3: 1 -2.28,-5.31; 3 2.28,-5.31 | smd 4.826 x 5.715: 4 0,1.588
SOT23 = smd 1 x 1.4: 1 -0.95,-1.1; 2 0.95,-1.1; 3 0,1.1
3386F = drill 0.813 pad 1.676 octagon: 1 -2.54,2.54; 2 0,-2.54; 3 2.54,2.54
M0805 = smd 1.3 x 1.6: 1 -0.95,0; 2 0.95,0
R0805' = smd 1.3 x 1.5: 1 -0.85,0; 2 0.85,0
TQFP32-08 = smd 1.27 x 0.559: 1 -4.293,2.8; 2 -4.293,2; 3 -4.293,1.2; 4 -4.293,0.4; 5 -4.293,-0.4; 6 -4.293,-1.2; 7 -4.293,-2; 8 -4.293,-2.8; 17 4.293,-2.8; 18 4.293,-2; 19 4.293,-1.2; 20 4.293,-0.4; 21 4.293,0.4; 22 4.293,1.2; 23 4.293,2; 24 4.293,2.8 | smd 0.559 x 1.27: 9 -2.8,-4.293; 10 -2,-4.293; 11 -1.2,-4.293; 12 -0.4,-4.293; 13 0.4,-4.293; 14 1.2,-4.293; 15 2,-4.293; 16 2.8,-4.293; 25 2.8,4.293; 26 2,4.293; 27 1.2,4.293; 28 0.4,4.293; 29 -0.4,4.293; 30 -1.2,4.293; 31 -2,4.293; 32 -2.8,4.293
U.FL = smd 2.2 x 0.85: P$1 0,1.375; P$2 0,-1.375 | smd 1.05 x 1: P$3 1.525,0; P$4 -1.525,0
WM9364CT-ND = smd 1.15 x 0.65: C1 -13.73,1.905; C2 -13.73,-0.635; C3 -13.73,-3.175; C5 -13.73,3.175; C6 -13.73,0.635; C7 -13.73,-1.905; P$7 -11.56,-6.325; P$8 -11.56,6.325; P$9 -9.56,-6.325; P$10 -9.56,6.325 | smd 1.7 x 1.4: P$11 0,6.105; P$12 0,-6.105
1751248 = drill 1.1 pad 1.7: 1 -1.75,-0.1; 2 1.75,-0.1
22-23-2041 = drill 1 long: 1 -3.81,0; 2 -1.27,0; 3 1.27,0; 4 3.81,0
22-23-2021 = drill 1 long: 1 -1.27,0; 2 1.27,0
RESONATOR-SMD = smd 0.7 x 1.7: 1 -1.2,0; 2 0,0; 3 1.2,0

### Placement (x,y rotation side)
AVR_SERIAL  46.67,21.59 90 top
C1  69.85,16.83 180 top
C3  46.2,48.9 90 top
C4  69.85,38.73 180 top
C5  69.85,47.94 180 top
C6  69.85,8.26 180 top
C78IN3  46.67,7.14 270 top
C_78IN  55.24,2.22 180 bottom
C_78IN2  55.24,7.94 180 bottom
C_78OUT  45.56,17.78 0 bottom
C_AVR1  21.59,20.32 180 top
C_AVR2  22.54,34.29 180 top
C_BULK2_TANT1  119.06,13.97 180 top
C_BULK2_TANT2  13.65,19.37 90 top
C_CLOCK  85.41,17.78 180 top
C_CON2  118.27,30.8 90 top
C_CON3  116.2,30.8 90 top
C_DTR  42.86,16.51 0 top
C_LMIN  55.24,47.78 0 bottom
C_LMIN1  55.24,45.72 0 bottom
C_LMIN2  61.91,37.78 180 top
C_LMIN3  61.91,35.56 180 top
C_OPAMP  2.86,32.7 90 top
C_PIEZO  6.99,15.88 90 bottom
C_SIM  87,43.18 90 top
C_VEXT  94.61,43.5 180 top
C_VEXT1  118.75,20.32 180 top
C_VEXT2  108.27,45.72 270 top
C_VEXT3  119.06,17.46 180 top
D1  55.88,38.73 90 top
D2  16.66,-17.81 0 bottom  (outside the outline)
D3  10.16,20.32 270 top
D4  8.26,20.32 90 top
D5  16.66,-14.05 0 bottom  (outside the outline)
D6  16.66,-21.56 0 bottom  (outside the outline)
D7  16.66,-25.32 0 bottom  (outside the outline)
D8  16.66,-29.08 0 bottom  (outside the outline)
D9  16.66,-32.84 0 bottom  (outside the outline)
D10  16.66,-36.6 0 bottom  (outside the outline)
D11  16.66,-40.36 0 bottom  (outside the outline)
D12  47.94,15.88 90 top
ESD  86.2,34.61 180 bottom
FERRITE  118.9,9.53 45 top
H1  123.51,52.07 0 top
H2  123.51,3.49 0 top
H3  3.49,52.07 0 top
H4  3.49,3.49 0 top
IC1  6.99,32.7 180 top
IC2  101.92,27.62 270 top
IC4  54.29,15.88 90 bottom
IC5  69.85,27.88 270 top
J1  34.45,22.07 90 top
JP2  14.61,28.57 0 top
JP5  16.51,34.29 180 top
JP6  47.31,39.21 0 top
JP7  47.31,42.07 0 top
L1  55.24,27.75 90 top
LED1  56.52,10.79 180 top
LED2  8.89,49.21 270 top
Q1  14.61,44.13 0 bottom
Q3  22.23,44.13 0 bottom
Q4  29.84,44.13 0 bottom
Q5  37.47,44.13 0 bottom
Q6  22.86,11.11 180 bottom
Q7  15.24,11.11 180 bottom
Q8  30.48,11.11 180 bottom
Q9  38.1,11.11 180 bottom
Q10  99.38,47.31 270 top
Q11  104.46,47.31 270 top
R2  5.71,12.06 90 top
R4  104.78,43.5 270 top
R5  106.36,51.12 90 top
R6  101.28,51.12 90 top
R7  98.11,43.5 270 top
R10  5.71,43.18 90 top
R_ADC  11.43,34.61 270 top
R_CHUTE  11.43,30.16 270 top
R_COMP  3.17,26.67 180 top
R_COMP1  3.17,24.45 0 top
R_DTR  42.86,21.59 0 top
R_DTR1  42.86,19.05 0 top
R_EN  64.93,21.59 90 bottom
R_FB  59.69,27.94 180 bottom
R_FB1  59.69,25.4 0 bottom
R_G1  16.51,43.18 270 top
R_G2  21.59,43.18 270 top
R_G3  26.67,43.18 270 top
R_G4  31.75,43.18 270 top
R_G5  19.05,12.06 90 top
R_G6  13.97,12.06 90 top
R_G7  24.13,12.06 90 top
R_G8  31.75,12.06 90 top
R_IN  6.99,20.32 270 bottom
R_LED  51.44,15.88 180 top
R_LED1  9.21,52.39 90 top
R_LED4  R_ANT  [R0805']  117.16,27.62 0 top
R_P1  13.97,43.18 270 top
R_P2  19.05,43.18 270 top
R_P3  24.13,43.18 270 top
R_P4  29.21,43.18 270 top
R_P5  21.59,12.06 90 top
R_P6  16.51,12.06 90 top
R_P7  26.67,12.06 90 top
R_P8  29.21,12.06 90 top
R_RESET_PUP  38.1,22.23 270 top
R_RXI  42.86,24.13 0 top
R_TXO  42.86,26.67 0 top
RRX  100.33,43.5 90 top
RSIM_CLK  85.41,22.54 0 top
RSIM_DATA  85.41,25.08 0 top
RSIM_RST  85.41,20 0 top
RTX  102.55,43.5 90 top
U1  22.86,27.3 90 top
U$1  120.81,27.62 180 top
U$2  83.5,53.98 90 bottom
X1  14.61,50.48 0 top
X2  55.24,50.48 0 top
X3  35.72,32.07 270 top
X4  55.24,5.08 180 top
X5  22.23,50.48 0 top
X6  29.84,50.48 0 top
X7  37.47,50.48 0 top
X8  22.86,5.08 180 top
X9  15.24,5.08 180 top
X10  30.48,5.08 180 top
X11  38.1,5.08 180 top
X12  3.65,20.32 90 top
Y1  26.04,20.32 0 top

### Tracks (layer width: path | path; a pad name or v marks a point on that pad's centre or on a via)
+5V  (via drill 0.3)
  Top 0.203: 2.9,31.75 C_OPAMP.1 | 8.89,31.11 IC1.8 | 22.46,20.45 C_AVR1.1 | R_RESET_PUP.2 38.1,17.46 | R5.2 R6.2 91.44,52.07 90.01,53.5 62.71,53.5 62.39,53.82 v61.75,53.82 61.59,53.98 | v49.53,17.14 49.53,16.83 R_LED.2
  Top 0.406: R10.1 1.27,38.42 1.27,32.38 1.91,31.75 2.81,31.75 C_OPAMP.1
  Top 0.508: U1.6 24.06,24.2 23.5,24.77 | 23.5,24.77 22.86,24.77 22.46,24.36 U1.4 22.46,20.45 | 2.9,31.75 8.26,31.75 8.89,31.11 | 23.5,24.77 23.5,30.16 23.26,30.4 U1.20 23.26,32.78 23.39,33.23 | R_COMP.2 2.23,31.07 C_OPAMP.1 | C_AVR2.1 23.39,33.23 | 22.46,20.45 22.54,20.37 | IC1.8 8.89,26.35 10.79,24.45 11.14,24.14 11.11,23.02 11.11,19.68 12.83,17.97 C_BULK2_TANT2.1 13.84,17.46 21.91,17.46 | 22.46,20.45 22.4,20.39 22.4,19.23 21.91,18.73 21.91,17.46 | U1.18 24.86,32.61 24.45,33.02 23.61,33.02 23.39,33.23 | 21.91,17.46 33.02,17.46 | 33.02,17.46 38.1,17.46 39.69,17.46 | J1.2 33.18,17.62 33.02,17.46 | v39.21,25.4 39.21,24.92 39.69,24.45 39.69,17.46 | 39.69,17.46 39.69,15.56 40.96,14.29 44.93,14.29 47.31,16.67
  Bottom 0.203: v61.75,53.82 61.44,54.13 60.64,54.13 60.33,53.82 50.8,53.82 47.62,50.8 47.62,44.45 48.58,43.5 48.58,19.07 IC4.2
  Bottom 0.508: X3.4 37.47,28.26 39.21,26.51 v39.21,25.4
  other vias: 49.53,18.1
  pour Top (no thermals): 50.16,18.73 50.16,16.19 46.83,16.19 46.83,18.73
  pour Bottom (no thermals): 50.16,18.73 50.16,16.83 45.72,16.83 45.72,18.73
A0
  Top 0.203: U1.23 20.86,32.48 19.05,34.29 JP5.1
C_CLK  (via drill 0.3)
  Top 0.203: IC2.32 87.28,21.62 RSIM_CLK.2 v86.84,22.07 | C_CLOCK.1 v86.84,18.41
  Bottom 0.203: 87,22.38 v86.84,22.07 v86.84,18.41
D2  (via drill 0.3)
  Top 0.203: U1.32 17.36,24.5 v16.51,23.65 | v16.51,20.95 16.51,21.11 12.54,25.09 12.54,28.11 R_CHUTE.2
  Bottom 0.203: v16.51,20.95 v16.51,23.65
D3
  Top 0.203: U1.1 20.06,22.6 20,22.54 18.41,22.54 17.78,21.91 16.35,21.91 13.02,25.24 13.02,36.2 13.97,37.15 R_P1.2 14.93,42.23 15.24,42.55 15.24,43.81 15.56,44.13 R_G1.1
D4  (via drill 0.3)
  Top 0.203: U1.2 20.86,22.13 20.64,21.91 18.41,21.91 17.62,21.11 v17.62,20.95 | R_P2.2 | R_P2.2 19.85,42.23 20.32,42.7 20.32,43.66 20.8,44.13 R_G2.1 | R_P2.2 19.05,41.44 13.49,35.88 13.49,25.4 16.51,22.38 17.14,22.38 v17.62,22.86
  Bottom 0.203: v17.62,22.86 v17.62,20.95
D5  (via drill 0.3)
  Top 0.203: U1.9 28.2,24.5 29.05,23.65 29.05,19.84 27.78,18.57 24.01,18.57 v23.65,18.41 | R_P5.2 21.59,14.28 v23.65,16.51 | R_G5.1 19.14,11.2 20.09,11.2 20.32,11.43 20.32,12.7 20.64,13.02 R_P5.2 | R_P5.2
  Bottom 0.203: v23.65,16.51 v23.65,18.41
D6  (via drill 0.3)
  Top 0.203: U1.10 28.35,25.3 v28.57,25.08 | v27.94,23.18 28.57,22.54 28.57,20 27.62,19.05 23.35,19.05 v22.7,18.41 | v22.7,16.51 19.05,16.51 16.51,13.97 R_P6.2 15.55,13.02 15.24,12.7 15.24,11.43 14.92,11.11 R_G6.1
  Bottom 0.203: v28.57,25.08 28.57,23.5 28.26,23.18 v27.94,23.18 | v22.7,16.51 v22.7,18.41
D7  (via drill 0.3)
  Top 0.203: U1.11 25.65,26.11 24.77,26.99 v24.77,29.21 | R_G3.1 25.88,44.13 25.4,43.66 25.4,42.7 24.93,42.23 R_P3.2 24.13,40.96 26.04,39.05 v26.04,33.18
  Bottom 0.203: v24.77,29.21 26.04,30.48 v26.04,33.18
D8  (via drill 0.3)
  Top 0.203: v25.4,28.57 25.4,27.3 25.8,26.91 U1.12 | R_G4.1 30.96,44.13 30.48,43.66 30.48,42.7 30.01,42.23 R_P4.2 29.21,41.27 30.16,40.32 31.75,40.32 32.7,39.37 32.7,38.1 31.75,37.15 27.94,37.15 26.67,35.88 26.67,33.97 26.99,33.66 26.99,32.7 v26.67,32.38
  Bottom 0.203: v25.4,28.57 26.67,29.84 v26.67,32.38
D9  (via drill 0.3)  (1 unrouted)
  Top 0.203: U1.13 28.49,27.7 29.53,26.67 29.53,19.68 29.52,18.75 v29.83,18.41 | R_P7.2 26.67,13.97 29.21,16.51 v29.83,16.51 | R_G7.1 25.09,11.12 25.4,11.43 25.4,12.7 25.71,13.02 R_P7.2
  Bottom 0.203: v29.83,18.41 v29.83,16.51
D10  (via drill 0.3)
  Top 0.203: U1.14 28.33,28.5 30,26.83 30,19.19 v30.94,18.41 | v30.94,16.51 30.3,15.88 29.84,15.88 29.21,15.24 R_P8.2 30.16,13.02 30.48,12.7 30.48,11.43 30.8,11.12 R_G8.1
  Bottom 0.203: v30.94,16.51 30.94,16.68 30.48,17.14 30.48,17.95 v30.94,18.41
FB  (via drill 0.3)  (1 unrouted)
  Top 0.203: IC5.4 63.64,26.18 63.5,26.04
  Bottom 0.203: R_FB.2 60.33,27.94 60.33,26.19 | R_FB1.1 60.33,25.4 60.33,26.19 | v63.34,26.19 60.33,26.19
GND  (via drill 0.3)
  Top 0.203: D3.C D4.A | Y1.2 v26.04,21.59
  Top 0.406: U1.5 23.26,21.82 v23.81,21.59
  other vias: 24.77,25.4 22.23,26.04 3.81,29.21 20.64,20.32 19.05,20.32 14.61,26.04 31.75,32.07 20.32,34.29 21.43,34.29 19.05,9.53 26.67,9.53 26.67,8.73 26.67,7.94 19.05,8.73 19.05,7.94 34.29,8.73 34.29,9.53 34.29,7.94 11.43,8.73 11.43,9.53 11.43,7.94 10.79,46.83 10.79,47.62 10.79,46.04 18.41,46.83 18.41,47.62 18.41,46.04 26.04,46.83 26.04,47.62 26.04,46.04 33.66,46.83 33.66,47.62 33.66,46.04 41.27,46.83 41.27,47.62 41.27,46.04 13.02,20.95 14.29,20.95 72.39,30 71.12,30 69.85,30 68.58,30 68.58,28.57 69.85,28.57 71.12,28.57 72.39,28.57 72.39,27.15 71.12,27.15 69.85,27.15 68.58,27.15 68.58,25.72 69.85,25.72 71.12,25.72 72.39,25.72 115.57,25.88 116.36,25.88 117.16,25.88 117.95,25.88 118.75,25.88 118.75,24.92 119.54,24.92 121.13,24.92 122.71,24.92 122.71,26.51 123.51,26.51 123.51,28.1 122.71,28.89 122.71,30.48 121.92,30.16 120.33,30.16 119.54,31.11 121.13,31.11 123.51,29.69 124.3,28.89 125.09,28.1 124.3,27.3 123.51,24.92 121.92,24.13 120.33,24.13 115.41,31.59 116.2,31.59 117,31.59 117.79,31.59 118.59,31.59 93.98,35.72 95.89,35.72 97.79,35.72 99.85,35.72 101.92,35.72 103.98,35.72 106.05,35.72 107.95,35.72 109.86,35.72 93.98,33.81 97.79,33.81 106.05,33.81 109.86,33.81 93.98,31.75 95.89,31.91 97.79,31.91 106.05,31.91 107.95,31.91 109.86,31.91 93.98,29.69 97.79,30 106.05,30 109.86,29.53 93.98,27.62 95.89,27.62 97.79,27.62 99.69,27.62 101.92,27.62 103.98,27.62 106.05,27.62 107.95,27.62 93.98,25.56 97.79,25.24 101.92,25.24 106.05,25.24 109.86,25.24 93.98,23.5 95.89,23.34 97.79,23.34 99.85,23.34 101.92,23.34 103.98,23.34 106.05,23.34 107.95,23.34 109.86,23.34 93.98,21.43 97.79,21.43 101.92,21.43 106.05,21.43 109.86,21.43 93.98,19.37 95.89,19.37 97.79,19.37 99.85,19.37 101.92,19.37 103.98,19.37 106.05,19.37 107.95,19.37 109.86,19.37 111.44,21.75 111.44,20.64 111.44,26.67 111.44,25.56 111.44,29.53 111.44,30.64 111.44,31.59 111.44,32.7 125.09,26.51 88.27,13.97 83.82,36.83 86.2,36.83 88.58,24.77 97.95,14.29 97.79,18.26 103.82,18.26 104.93,18.26 104.93,14.29 103.82,14.29 90.65,36.83 92.55,35.72 93.82,36.99 92.71,38.89 93.98,40.96 111.28,38.89 113.19,36.99 113.19,38.89 113.19,18.41 113.19,16.35 111.12,16.35 90.65,38.89 90.65,18.57 90.65,16.35 92.71,16.35 79.38,41.91 81.28,41.91 83.19,41.91 85.09,41.91 83.19,43.81 79.38,43.81 77.47,43.81 77.47,45.72 77.47,47.62 77.47,49.53 79.38,47.62 81.28,45.72 85.09,45.72 87,44.45 87,47.62 83.19,47.62 81.28,49.53 85.09,49.53 88.9,49.53 88.9,47.62 88.9,45.72 88.9,43.81 88.9,41.91 88.9,51.44 87,51.44 85.09,51.44 83.19,51.44 81.28,51.44 79.38,51.44 77.47,51.44 106.36,40.96 103.66,40.96 98.42,40.96 114.94,21.59 114.94,20.64 125.09,29.69 124.3,30.48 125.09,31.27 124.3,31.91 125.09,32.7 124.3,33.34 125.09,33.97 124.3,34.61 123.35,32.7 123.35,33.97 122.71,32.07 122.71,33.34 124.3,25.72 125.09,24.92 124.3,24.13 125.09,23.34 91.12,53.98 93.03,53.98 94.93,53.98 96.84,53.98 98.74,53.98 100.65,53.98 102.55,53.98 104.46,53.98 106.36,53.98 108.27,53.98 110.17,53.98 112.08,53.98 113.98,53.98 115.25,52.7 116.52,51.44 117.79,50.16 119.06,48.9 120.33,47.62 121.6,46.35 122.87,45.09 124.14,43.81 125.41,42.55 125.41,40.64 125.41,38.73 125.41,36.83 125.41,35.56 125.09,21.43 125.09,19.53 125.09,17.62 125.09,15.72 125.09,13.81 125.09,11.91 123.83,10.64 121.92,8.89 120.65,7.62 119.38,6.35 118.11,5.08 116.84,3.81 115.57,2.54 114.3,1.59 112.39,1.59 110.49,1.59 108.58,1.59 106.68,1.59 104.78,1.59 102.87,1.59 100.97,1.59 99.06,1.59 97.16,1.59 95.25,1.59 93.34,1.59 91.44,1.59 89.53,1.59 87.63,1.59 79.38,40.01 80.01,38.1 81.28,36.83 81.92,35.56 81.92,34.29 81.92,33.02 81.92,31.75 81.92,30.48 81.92,29.21 81.92,27.94 81.92,26.67 81.92,25.4 81.92,24.13 81.92,22.86 81.92,21.59 81.92,20.32 81.92,19.05 80.64,17.78 80.01,16.51 78.74,15.24 78.11,13.97 77.47,12.7 77.47,11.43 77.47,10.16 77.47,8.57 60.33,44.45 59.05,44.45 59.05,43.18 60.33,43.18 57.78,43.18 57.78,44.45 56.52,43.18 55.24,43.18 53.98,43.18 52.7,43.18 52.7,44.45 53.98,44.45 73.66,46.35 72.39,46.35 72.39,45.09 73.66,45.09 73.66,36.83 73.66,35.56 72.39,36.83 72.39,35.56 73.66,18.41 72.39,18.41 72.39,19.68 73.66,19.68 73.66,10.16 72.39,10.16 72.39,11.43 73.66,11.43 60.96,35.56 60.96,37.78 87.63,40.01 88.58,29.21 86.04,29.21 111.28,42.7 111.28,45.88 111.28,49.05 111.28,52.23 114.46,45.88 114.46,42.7 114.46,49.05 117.63,45.88 117.63,42.7 120.81,42.7 120.81,39.53 117.63,39.53 117.63,36.35 120.81,36.35 120.81,33.18 117.63,33.18 115.73,36.35 115.73,39.53 105.41,8.57 103.5,8.57 101.6,8.57 99.69,8.57 97.79,8.57 95.89,8.57 93.98,8.57 92.08,8.57 90.17,8.57 88.27,8.57 86.36,8.57 84.45,8.57 82.55,8.57 80.64,8.57 78.74,8.57 106.68,8.57 107.95,8.57 109.22,8.57 110.49,8.57 111.76,8.57 113.03,8.57 114.3,8.57 115.57,9.84 116.84,10.48 117.47,11.75 116.2,11.75 117.47,13.02 117.47,14.29 117.47,16.83 117.47,18.1 117.63,20.32 116.52,21.43 92.71,47.62 92.71,43.81 95.25,47.62 115.41,32.54 115.41,33.5 108.11,42.7 108.11,49.05 88.27,17.78 92.08,13.97 95.89,13.97 99.85,14.29 106.84,14.29 110.01,14.13 113.19,14.13 113.19,10.95 110.01,10.95 106.84,10.95 103.66,10.95 99.85,10.95 96.04,10.95 92.23,10.95 88.42,10.95 84.61,10.95 80.8,10.95 80.8,14.13 84.61,14.13 82.71,17.94 1.91,22.86 50.01,47.62 50.01,46.83 50.01,46.04 46.35,47.62 46.35,46.83 46.35,46.04 49.69,36.51 47.47,36.51 47.62,33.18 49.53,33.18 49.53,27.78 47.78,27.78 47.78,22.86 49.37,22.86 49.37,19.84 47.78,19.84 41.91,8.73 41.91,9.53 41.91,7.94 46.99,8.73 46.99,9.53 46.99,7.94 56.52,8.73 56.52,9.53 56.52,7.94 121.92,22.23
  pour Top (rank 6, no thermals): 48.26,55.88 75.56,55.88 75.56,-2.54 48.26,-2.54
  pour Bottom (rank 3, no thermals): -13.97,71.12 48.26,71.12 48.26,-12.06 -13.97,-12.06
  pour Top (rank 2, no thermals): -11.43,48.74 48.26,48.74 48.26,5.08 -11.43,5.08
  pour Bottom (rank 4, no thermals): 45.72,59.05 82.55,59.05 82.55,-4.13 45.72,-4.13
  pour Top (rank 2, no thermals): 86.36,56.83 86.36,-1.27 127.95,-1.27 127.95,56.83
  pour Top (no thermals): 74.93,40.96 79.38,35.24 79.38,20.32 74.93,14.61
  pour Top: 76.83,57.15 76.83,41.91 81.28,35.72 81.28,19.68 76.83,13.97 76.83,7.62 90.81,7.62 90.81,57.15
  pour Bottom (no thermals): 76.83,57.78 76.83,41.91 81.28,35.72 81.28,19.68 76.83,13.97 76.83,-4.45 130.18,-4.45 130.18,57.78
  pour Bottom (no thermals): 59.05,12.06 59.05,0.64 55.56,0.64 55.56,12.06
  pour Top (rank 2, no thermals): 46.99,48.74 46.99,43.02 51.12,43.02 51.12,48.74
  pour Bottom (no thermals): 52.7,51.44 51.44,50.16 51.44,46.99 55.24,46.99 55.24,51.44
MISO
  Top 0.203: U1.16 28,30.11 30.96,27.15 30.96,24.29 31.91,23.34 33.81,23.34 34.29,22.86 34.29,20.95 J1.1
MOSI
  Top 0.203: U1.15 28.16,29.3 30.48,26.99 30.48,23.81 32.23,22.07 J1.4
N$1  (via drill 0.3)  (1 unrouted)
  Top 0.203: R_G1.2 16.51,40.96 v16.99,40.48
  Bottom 0.203: Q1.1 16.89,40.38 v16.99,40.48
N$2
  pour Top (rank 2, no thermals): 52.39,38.73 59.21,38.73 59.21,34.29 65.41,30.32 65.41,28.73 52.39,28.73
N$3
  Bottom 0.203: C_PIEZO.1 3.44,14.88 R2.3
N$4  (1 unrouted)
  Bottom 1.626: 12.86,53.02 X1.1
  pour Bottom (no thermals): 11.91,52.07 11.91,42.86 17.3,42.86 17.3,52.07
N$5
  Top 0.203: U1.7 24.86,20.34 Y1.1
N$6
  Top 0.406: 118.27,27.62 C_CON2.1
  Top 1.27: R_LED4.2 118.27,27.62 U$1.P$3
N$7
  Top 0.203: 115.63,27.62 IC2.60
  Top 0.406: C_CON3.1 116.2,28 R_LED4.1
  Top 1.15: R_LED4.1 115.63,27.62
  pour Top (no thermals): 114.41,28.01 115.57,28.19 115.57,27.05 114.4,27.24
N$8
  Top 0.203: IC2.31 87.71,22.62 87.47,22.86 87.47,23.34 86.36,24.45 RSIM_DATA.2
N$9  (1 unrouted)
N$10
  Bottom 0.203: R_IN.1 3.97,21.27 X12.2
N$11
  Top 0.203: U1.8 25.88,23.01 27.3,21.59 27.3,20.39 Y1.3
N$12
  Top 0.203: IC2.33 86.98,20.62 RSIM_RST.2
N$13
  Top 0.203: IC1.6 6.35,15.07 8.26,13.16 R2.2
N$15  (via drill 0.3)
  Top 0.203: JP5.2 v15.56,34.92 | v12.03,34.9 R_ADC.1
  Bottom 0.203: v15.56,34.92 12.84,34.92 v12.03,34.9
N$16
  Top 0.203: IC1.2 7.62,42.55 R10.2
N$18
  pour Top (no thermals): 112.08,22.38 116.96,22.38 arc-45 118.38,21.8 119.06,21.11 119.06,9.68 119.87,9.68 arc90 122.87,12.68 122.87,19.14 arc47 122.24,20.59 118.21,24.38 arc43 116.84,24.92 112.08,24.92
N$20
  Top 0.203: LED2.A 7.84,50.38 8.89,51.44 R_LED1.1
N$22  (via drill 0.3)
  Top 0.203: D3.A 10.16,18.68 9.53,19.32 | D4.C 8.68,18.47 9.53,19.32 | 9.53,19.32 v9.53,19.37
  Bottom 0.203: C_PIEZO.2 R_IN.2 v9.52,19.37 v9.53,19.37
N$26  (via drill 0.3)
  Top 0.203: R2.1 7.62,9.53 9.53,11.43 9.53,12.7 8.89,13.34 8.58,13.64 7.31,14.91 6.99,15.24 6.99,27.94 v7.62,28.57 IC1.7 | IC1.3 6.35,33.97 v7.62,32.7 9.21,32.7 10.16,33.66 R_ADC.2
  Bottom 0.203: v7.62,32.7 v7.62,28.57
N$28  (via drill 0.3)
  Top 0.203: R_G2.2 21.59,41.91 v23.5,40.01
  Bottom 0.203: v23.5,40.01 23.5,39.83 Q3.1
N$36
  Bottom 1.626: 20.48,53.02 X5.1
  pour Bottom (no thermals): 19.53,52.07 19.53,42.86 24.92,42.86 24.92,52.07
N$38
  Top 0.203: R_DTR.1 R_DTR1.1 41.86,19 C_DTR.1
N$39
  Top 0.203: AVR_SERIAL.TXO R_TXO.2
N$40
  Top 0.203: R_RXI.2 AVR_SERIAL.RXI
N$41
  Top 0.203: R_DTR.2 AVR_SERIAL.DTR
N$47  (via drill 0.3)
  Top 0.203: R_G3.2 26.67,41.91 29.84,38.73 v31.11,38.73
  Bottom 0.203: v31.11,38.73 32.04,38.73 Q4.1
N$48  (1 unrouted)
  Bottom 1.626: 28.09,53.02 X6.1
  pour Bottom (no thermals): 27.15,51.91 27.15,42.7 32.54,42.86 32.54,52.07
N$49  (via drill 0.3)
  Top 0.203: R_G4.2 36.52,42.23 37.15,42.23 39.05,40.32 v39.05,40.01
  Bottom 0.203: v39.05,40.01 39.69,40.01 39.69,38.88 Q5.1
N$50
  Top 0.203: LED1.A R_LED.1
N$51  (1 unrouted)
  Bottom 1.626: X7.1 35.72,52.55 35.24,53.02
  pour Bottom (no thermals): 34.77,51.91 34.77,42.7 40.16,42.7 40.16,52.07
N$52  (via drill 0.3)
  Top 0.203: R_G5.2 19.05,13.97 v20.64,15.56
  Bottom 0.203: v20.64,15.56 20.58,15.62 Q6.1
N$53  (1 unrouted)
  pour Bottom (no thermals): 20.16,12.38 20.16,3.17 25.56,3.17 25.56,12.38
N$54  (via drill 0.3)
  Top 0.203: v13.34,15.56 13.97,14.92 R_G6.2
  Bottom 0.203: Q7.1 13.34,16.05 v13.34,15.56
N$55  (1 unrouted)
  pour Bottom (no thermals): 12.54,12.38 12.54,3.17 17.94,3.17 17.94,12.38
N$56  (via drill 0.3)
  Top 0.203: R_G7.2 24.45,13.02 24.13,13.33 24.13,13.97 26.35,16.19 v27.46,16.19
  Bottom 0.203: Q8.1 27.8,16.19 v27.46,16.19
N$57  (1 unrouted)
  pour Bottom (no thermals): 27.78,12.38 27.78,3.17 33.18,3.17 33.18,12.38
N$58  (via drill 0.3)
  Top 0.203: R_G8.2 33.02,14.29 35.24,14.29 35.88,14.92 v35.88,15.24
  Bottom 0.203: v35.88,15.24 35.88,16.19
  Bottom 0.508: Q9.1 35.88,16.36 35.88,16.19
N$59  (1 unrouted)
  pour Bottom (no thermals): 35.4,12.38 35.4,3.17 40.8,3.17 40.8,12.38
N$60
  Top 0.203: IC2.9 101.92,41.91 RTX.1
N$61
  Top 0.203: IC2.10 100.92,42.12 RRX.1
N$67  (via drill 0.3)
  Top 0.203: R5.1 105.56,49.36 Q11.3 105.56,49.38 105.41,49.53 103.82,49.53 102.23,51.12 91.76,51.12 89.85,53.02 62.23,53.02 62.07,53.18 v60.96,53.18
  Bottom 0.203: v60.96,53.18 50.96,53.18 48.26,50.48 48.26,45.09 50.01,43.34 50.01,42.09 JP7.2
N$71  (via drill 0.3)  (1 unrouted)
  Top 0.203: R6.1 100.48,49.36 Q10.3 100.48,49.22 100.17,49.53 92.71,49.53 89.69,52.55 v61.75,52.55
  Bottom 0.203: 50.16,39.37 51.44,40.64 51.44,43.18 48.9,45.72 48.9,50.16 51.28,52.55 60.33,52.55 60.64,52.23 61.44,52.23 v61.75,52.55
N$79  (via drill 0.3)
  Bottom 0.203: R_FB1.2 58.74,25.09 v58.74,23.97
  pour Top (no thermals): 52.39,24.45 52.39,18.1 67.63,2.86 114.62,2.86 119.06,7.3 71.44,7.3 67.63,11.27 67.63,16.83 60.01,24.45
  pour Top (no thermals): 119.06,9.05 117,9.05 115.09,7.3 119.06,7.3
N$80  (via drill 0.3)
  Top 0.508: v64.93,24.4 IC5.5
  Bottom 0.203: R_EN.2 v64.93,24.4
N$82  (via drill 0.3)
  Top 0.203: 8.89,35.62 IC1.1 9.15,35.3 v9.84,34.61 | R_CHUTE.1
  Bottom 0.203: v9.84,34.61 9.84,32.7 11.11,31.43 R_CHUTE.1
  other vias: 11.43,31.11
RESET  (via drill 0.3)
  Top 0.203: JP2.2 16.43,27.17 16.43,26.91 U1.29 21.19,26.91 v22.54,28.26 | v27.94,32.38 27.94,31.75 32.86,26.67 33.66,26.67 J1.5 38.1,24.61 R_RESET_PUP.1 v38.58,23.18 | C_DTR.2 43.86,15.92 43.18,15.24 41.12,15.24 40.8,15.56 40.8,23.02 v40.64,23.18
  Bottom 0.203: v22.54,28.26 24.45,28.26 24.77,27.94 25.72,27.94 27.3,29.53 27.3,31.75 v27.94,32.38 | v40.64,23.18 v38.58,23.18
ROITE
  Top 0.203: IC1.5 5.08,27.62 R_COMP.1 R_COMP1.2
RX  (via drill 0.3)
  Top 0.203: U1.30 19.93,26.11 v20,26.04 | v29.53,32.38 29.53,32.23 30.48,31.27 30.48,30.8 31.75,29.53 37.62,29.53 39.21,31.11 | R_TXO.1 41.91,29.85 v41.91,31.11 | 39.21,31.11 39.21,35.72 45.56,42.07 JP7.1 | v38.73,31.11 39.21,31.11
  Bottom 0.203: v20,26.04 20.32,26.04 21.59,27.3 26.35,27.3 27.94,28.89 27.94,30.8 v29.53,32.38 | v41.91,31.11 v38.73,31.11
SCK
  Top 0.203: U1.17 27.14,31.6 32.54,26.19 33.5,26.19 34.29,25.4 34.29,23.5 J1.3
SCL  (via drill 0.3)
  Top 0.203: U1.28 17.38,27.7 13.97,31.11 13.97,35.56 14.76,36.35 24.29,36.35 v24.45,36.51 | v27.94,36.04 27.94,34.61 28.26,34.29 32.38,34.29 34.92,31.75 34.92,31.59 X3.3
  Bottom 0.203: v24.45,36.51 24.77,36.51 25.56,35.72 27.62,35.72 v27.94,36.04
SDA  (via drill 0.3)
  Top 0.203: U1.27 17.21,28.5 14.61,31.11 14.61,35.4 14.92,35.72 24.29,35.72 v24.77,35.24 | v28.57,35.24 32.38,35.24 34.29,33.34 X3.2
  Bottom 0.203: v24.77,35.24 v28.57,35.24
SIM_CLK  (via drill 0.3)  (1 unrouted)
  Top 0.203: v83.5,35.08 83.5,22.86 83.82,22.54 RSIM_CLK.1
  Bottom 0.203: U$2.C3 80.33,39.05 83.47,35.91 ESD.3 83.53,35.91 83.5,35.88 v83.5,35.08
SIM_DATA  (via drill 0.3)
  Top 0.203: v84.45,35.08 83.98,34.61 83.98,25.88 84.46,25.4 RSIM_DATA.1
  Bottom 0.203: U$2.C7 81.6,39.05 83.03,37.62 86.52,37.62 87.15,36.99 ESD.1 87.15,34.92 86.04,34.92 84.61,34.92 v84.45,35.08
SIM_RST  (via drill 0.3)
  Top 0.203: RSIM_RST.1 84.14,20 83.03,21.11 83.03,32.07 v82.71,32.38
  Bottom 0.203: U$2.C2 82.87,39.05 83.82,38.1 86.84,38.1 87.79,37.15 87.79,34.13 87.15,33.49 ESD.5 87.15,33.5 86.2,34.45 84.93,34.45 v82.71,32.38
SIM_RX
  Top 0.203: RRX.2 R7.1 98.28,44.62 Q10.2
SIM_TX
  Top 0.203: R4.1 RTX.2 103.36,45.25 Q11.2
SIM_VDD  (via drill 0.3)
  Top 0.203: 87.98,23.62 87.31,24.29 87.31,26.04 86.84,26.51
  Top 0.406: IC2.30 87.98,23.62 | 86.84,26.51 84.61,26.51 84.61,30.98 v85.86,32.23 | C_SIM.1 87,41.59 v85.41,40.01
  Bottom 0.254: U$2.C1 v85.41,40.01 85.41,39.05 85.72,38.58 87.15,38.58 88.27,37.47 88.27,33.02 87.47,32.23 v85.86,32.23 ESD.4
  Bottom 0.406: v85.41,40.01 85.33,40.01 U$2.C1
TX  (via drill 0.3)
  Top 0.203: U1.31 19.46,25.3 v20,24.77 | v29.53,31.11 29.69,31.11 29.69,30.8 33.34,27.15 33.81,27.15 34.29,26.67 36.99,26.67 38.5,28.18 | 38.5,28.18 39.69,29.37 39.69,35.56 43.5,39.21 JP6.1 | R_RXI.1 41.27,24.13 40.32,25.08 40.32,26.35 38.5,28.18
  Bottom 0.203: v20,24.77 21.91,26.67 26.67,26.67 28.57,28.57 28.57,30.16 v29.53,31.11
VDD_EXT  (1 unrouted)
  Top 0.203: Q10.1 98.28,48.09 99.38,47.15 99.38,46.51 99.54,46.2 101.6,46.2 102.08,46.67 102.08,47.78 102.55,48.26 Q11.1 | C_VEXT2.1 107.05,46.72 106.36,46.04 106.2,46.04 | 106.2,46.04 104.78,46.04 104.46,46.35 104.46,46.99 104.14,47.31 104.14,47.47 103.5,48.1 | R4.2 105.41,42.55 106.36,43.5 106.36,45.88 106.2,46.04 | C_VEXT.1 96.2,43.5 96.52,43.81
  Top 0.406: R7.2 96.52,42.55 | IC2.15 95.92,42.58 96.52,42.55 | 96.52,42.55 96.52,43.81 96.52,47.09 97.69,48.26 Q10.1
VIN  (3 unrouted)
  Bottom 1.626: 16.36,53.02 X1.2 | 23.98,53.02 X5.2 | 31.59,53.02 X6.2 | X7.2 39.22,52.62
  pour Top (no thermals): -4.45,63.82 51.44,63.82 51.44,49.05 -4.45,49.05
  pour Top: 48.9,59.37 65.41,59.37 65.41,48.9 55.56,48.9 55.56,52.07 48.9,52.07
  pour Top (no thermals): 63.02,30.64 65.88,30.64 65.88,49.05 63.02,49.05
  pour Top (no thermals): 66.04,35.56 68.58,38.1 68.58,49.21 65.41,52.39 65.41,35.56
  pour Bottom (no thermals): 55.56,45.09 55.56,50.16 56.67,51.28 57.94,51.28 57.94,47.15 57.94,46.04 56.83,44.93 55.72,44.93
VIN2  (via drill 0.3)  (4 unrouted)
  Top 0.203: D12.C 48.79,14.07 v49.21,13.65
  Bottom 0.203: v49.21,13.65 49.53,13.65
  Bottom 1.626: 21.11,3.26 X8.2 | 13.49,3.26 X9.2 | 28.73,3.26 X10.2 | 36.35,2.94 X11.2
  pour Top (no thermals): -4.76,6.67 54.93,6.67 54.93,-10 -4.76,-10
  pour Bottom (rank 3, no thermals): 54.93,14.29 54.93,0.64 48.58,0.64 48.58,14.29